# Altium schematic sheet Memory.SchDoc
size A4; SheetNumber: 5; SheetTotal: 9
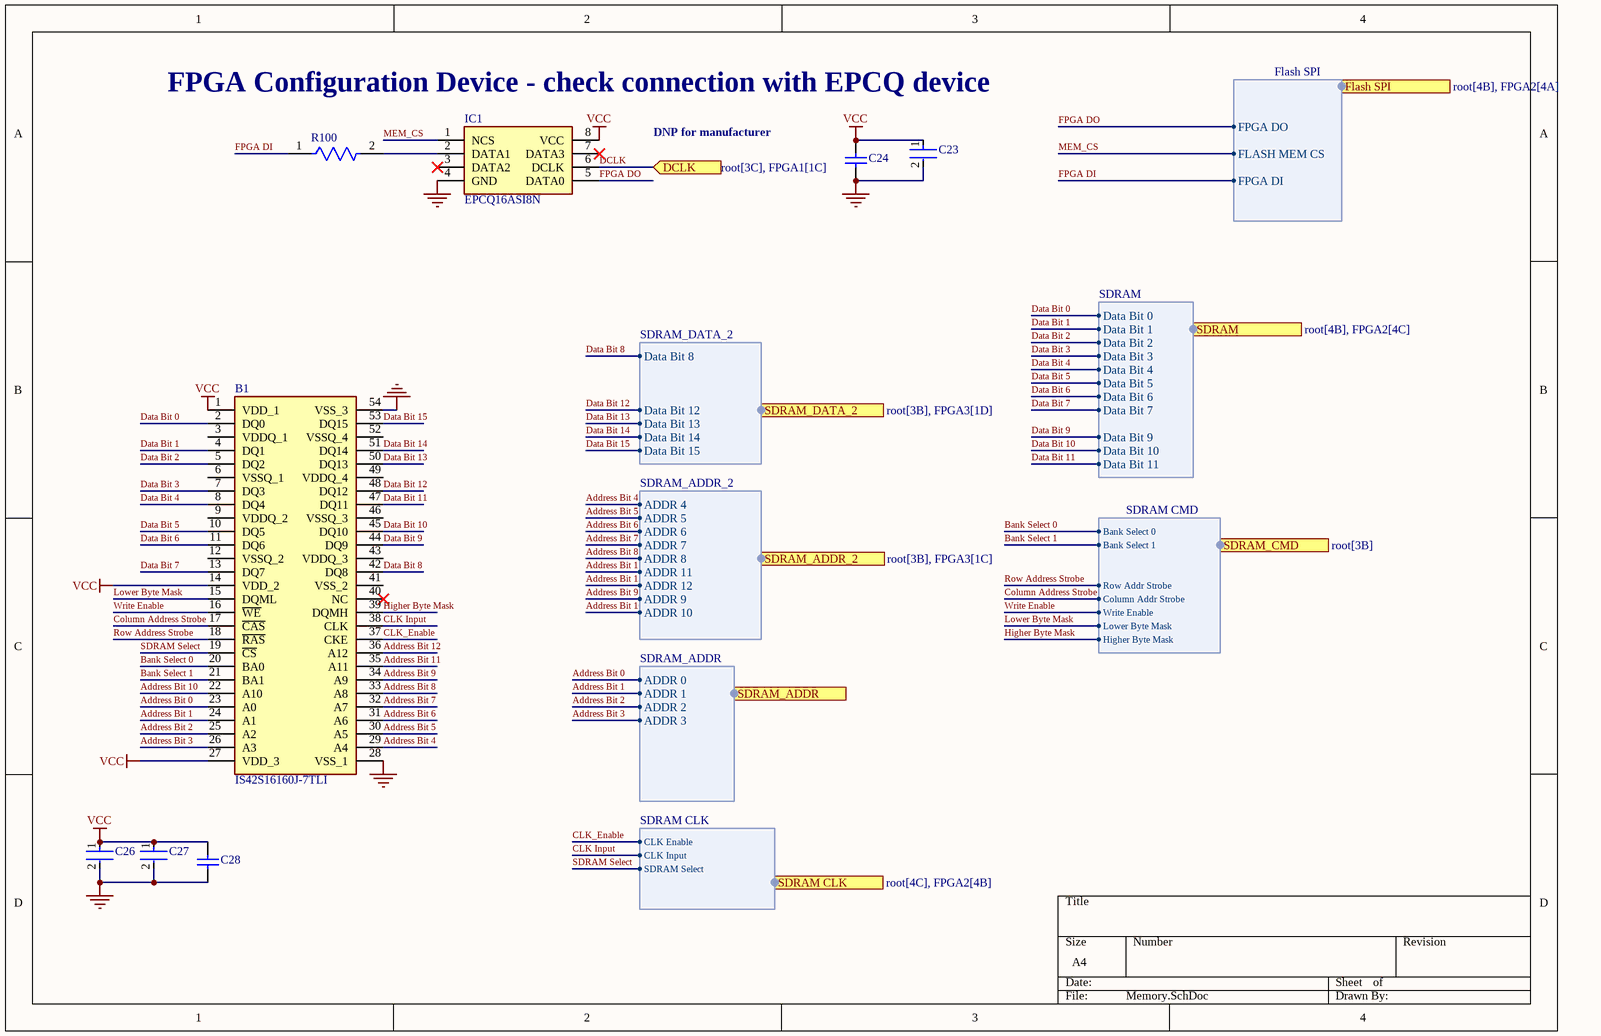
[diagram p0: Memory.SchDoc]

## Parts
B1  IS42S16160J-7TLI  [SOP80P1176X120-54N]
C23  CC0402KRX7R7BB104  [FP-CC0402-MFG]  (value not drawn)
C24  C0603C105K9PACTU  [CAPC1608X90X35LL15T15]  (value not drawn)
C26  CC0603KRX7R9BB104  [FP-CC0603-DA-MFG]  (value not drawn)
C27  CL21A475KAQNNNE  [FP-CL21-IPC_A]  (value not drawn)
C28  C0603C105K9PACTU  [CAPC1608X90X35LL15T15]  (value not drawn)
IC1  EPCQ16ASI8N  [SOIC127P600X175-8N]
R100  RC0402JR-0722RL  [FP-RC0402-0_4-IPC_B]  (value not drawn)

## Ports
DCLK (in, see root[3C], FPGA1[1C]), Flash SPI (harness Flash SPI, see root[4B], FPGA2[4A]), SDRAM (harness SDRAM, see root[4B], FPGA2[4C]), SDRAM CLK (harness SDRAM CLK, see root[4C], FPGA2[4B]), SDRAM_ADDR (harness SDRAM_ADDR, see root[4B], FPGA2[4C]), SDRAM_ADDR_2 (harness SDRAM_ADDR_2, see root[3B], FPGA3[1C]), SDRAM_CMD (harness SDRAM CMD, see root[3B]), SDRAM_DATA_2 (harness SDRAM_DATA_2, see root[3B], FPGA3[1D])

## Harnesses
Flash SPI: FPGA DO, FLASH MEM CS, FPGA DI
SDRAM: Data Bit 0, Data Bit 1, Data Bit 2, Data Bit 3, Data Bit 4, Data Bit 5, Data Bit 6, Data Bit 7, Data Bit 9, Data Bit 10, Data Bit 11
SDRAM_ADDR: ADDR 0, ADDR 1, ADDR 2, ADDR 3
SDRAM CMD: Bank Select 0, Bank Select 1, Row Addr Strobe, Column Addr Strobe, Write Enable, Lower Byte Mask, Higher Byte Mask
SDRAM CLK: CLK Enable, CLK Input, SDRAM Select
SDRAM_ADDR_2: ADDR 4, ADDR 5, ADDR 6, ADDR 7, ADDR 8, ADDR 11, ADDR 12, ADDR 9, ADDR 10
SDRAM_DATA_2: Data Bit 12, Data Bit 13, Data Bit 14, Data Bit 15, Data Bit 8

## Nets
GND: B1.28(VSS_1) B1.54(VSS_3) C23.2 C24.1 C26.2 C27.2 C28.1 IC1.4(GND)
VCC: B1.1(VDD_1) B1.14(VDD_2) B1.27(VDD_3) C23.1 C24.2 C26.1 C27.1 C28.2 IC1.8(VCC)
Address Bit 0: B1.23(A0) ; port SDRAM_ADDR.ADDR 0
Address Bit 1: B1.24(A1) ; port SDRAM_ADDR.ADDR 1
Address Bit 2: B1.25(A2) ; port SDRAM_ADDR.ADDR 2
Address Bit 3: B1.26(A3) ; port SDRAM_ADDR.ADDR 3
Address Bit 4: B1.29(A4) ; port SDRAM_ADDR_2.ADDR 4
Address Bit 5: B1.30(A5) ; port SDRAM_ADDR_2.ADDR 5
Address Bit 6: B1.31(A6) ; port SDRAM_ADDR_2.ADDR 6
Address Bit 7: B1.32(A7) ; port SDRAM_ADDR_2.ADDR 7
Address Bit 8: B1.33(A8) ; port SDRAM_ADDR_2.ADDR 8
Address Bit 9: B1.34(A9) ; port SDRAM_ADDR_2.ADDR 9
Address Bit 10: B1.22(A10) ; port SDRAM_ADDR_2.ADDR 10
Address Bit 11: B1.35(A11) ; port SDRAM_ADDR_2.ADDR 11
Address Bit 12: B1.36(A12) ; port SDRAM_ADDR_2.ADDR 12
Bank Select 0: B1.20(BA0) ; port SDRAM_CMD.Bank Select 0
Bank Select 1: B1.21(BA1) ; port SDRAM_CMD.Bank Select 1
CLK Input: B1.38(CLK) ; port SDRAM CLK.CLK Input
CLK_Enable: B1.37(CKE) ; port SDRAM CLK.CLK Enable
Column Address Strobe: B1.17(~{CAS}) ; port SDRAM_CMD.Column Addr Strobe
Data Bit 0: B1.2(DQ0) ; port SDRAM.Data Bit 0
Data Bit 1: B1.4(DQ1) ; port SDRAM.Data Bit 1
Data Bit 2: B1.5(DQ2) ; port SDRAM.Data Bit 2
Data Bit 3: B1.7(DQ3) ; port SDRAM.Data Bit 3
Data Bit 4: B1.8(DQ4) ; port SDRAM.Data Bit 4
Data Bit 5: B1.10(DQ5) ; port SDRAM.Data Bit 5
Data Bit 6: B1.11(DQ6) ; port SDRAM.Data Bit 6
Data Bit 7: B1.13(DQ7) ; port SDRAM.Data Bit 7
Data Bit 8: B1.42(DQ8) ; port SDRAM_DATA_2.Data Bit 8
Data Bit 9: B1.44(DQ9) ; port SDRAM.Data Bit 9
Data Bit 10: B1.45(DQ10) ; port SDRAM.Data Bit 10
Data Bit 11: B1.47(DQ11) ; port SDRAM.Data Bit 11
Data Bit 12: B1.48(DQ12) ; port SDRAM_DATA_2.Data Bit 12
Data Bit 13: B1.50(DQ13) ; port SDRAM_DATA_2.Data Bit 13
Data Bit 14: B1.51(DQ14) ; port SDRAM_DATA_2.Data Bit 14
Data Bit 15: B1.53(DQ15) ; port SDRAM_DATA_2.Data Bit 15
DCLK: IC1.6(DCLK) ; port DCLK
FPGA DI: R100.1 ; port Flash SPI.FPGA DI
FPGA DO: IC1.5(DATA0) ; port Flash SPI.FPGA DO
Higher Byte Mask: B1.39(DQMH) ; port SDRAM_CMD.Higher Byte Mask
Lower Byte Mask: B1.15(DQML) ; port SDRAM_CMD.Lower Byte Mask
MEM_CS: IC1.1(NCS) ; port Flash SPI.FLASH MEM CS
Row Address Strobe: B1.18(~{RAS}) ; port SDRAM_CMD.Row Addr Strobe
SDRAM Select: B1.19(~{CS}) ; port SDRAM CLK.SDRAM Select
Write Enable: B1.16(~{WE}) ; port SDRAM_CMD.Write Enable
NetIC1_2: IC1.2(DATA1) R100.2

Not connected (* = marked no-connect by the designer): B1 3(VDDQ_1) 6(VSSQ_1) 9(VDDQ_2) 12(VSSQ_2) 40(NC)* 41(VSS_2) 43(VDDQ_3) 46(VSSQ_3) 49(VDDQ_4) 52(VSSQ_4); IC1 3(DATA2)* 7(DATA3)*

## Notes on the sheet
- FPGA Configuration Device - check connection with EPCQ device
- DNP for manufacturer

## Library data of the parts
B1 = CMP-007-000000-1: DRAM 256M, 3.3V, SDRAM 16Mx16 143MHz; Manufacturer_Name: Integrated Silicon Solution Inc.; Geometry.Height: 1.2mm; Mouser Part Number: 870-IS42S16160J-7TLI; Mouser Price/Stock: https://www.mouser.co.uk/ProductDetail/ISSI/IS42S16160J-7TLI?qs=uCnMRCNammmen%252BmWnq1g5A%3D%3D; Source: IS42S16160J-7TLI.SchLib; Datasheet Link: http://www.issi.com/WW/pdf/42-45S83200J-16160J.pdf; Manufacturer_Part_Number: IS42S16160J-7TLI; Design Item ID: IS42S16160J-7TLI
C23 = CMP-03422-000048-1: CAP CER 0.1UF 16V X7R 0402; Manufacturer: YAGEO; Material: Ceramic; Automotive Grade: NA; Capacitance: 100 nF; Temperature Coefficient: 30ppm/°C; Tolerance: 0.1; Value: 100 nF; Device Class L1: Passive Components; Temperature Range Low: -55°C; Device Class L3: Ceramic Capacitors; Temperature Characteristic: X7R; Ipc Land Pattern Name: CAPC10050X50; Temperature Range High: +125°C; Voltage Rating: 16 V; Temperature: -55°C to +125°C; RoHS: TRUE; Automotive: No; Height: 0.55mm; Device Class L2: Capacitors; Digikey Description: CAP CER 0.1UF 16V X7R 0402; Package: CC0402; Footprint Url: http://www.yageo.com/exep/pages/download/literatures/UPY-C_GEN_24.pdf; ComponentLink2Description: Datasheet; Category: Cap; Lead Free: Yes; Octopart: https://octopart.com/cc0402krx7r7bb104-yageo-42244624; ComponentLink2URL: http://www.yageo.com/documents/recent/UPY-GP_NP0_16V-to-50V_16.pdf; Manufacturer Part Number: CC0402KRX7R7BB104; Mouser Description: 0402 0.1 uF 16 V ±10 % Tolerance X7R SMT Multilayer Ceramic Capacitor
C24 C28 = CMP-2006-02241-1: Manufacturer: Kemet; Part Number: C0603C105K9PACTU
C26 = CMP-2100-03601-2: CAP CER 0.1UF 50V X7R 0603; Manufacturer: YAGEO; Material: Ceramic; Capacitance: 100 nF; Temperature Coefficient: 15%; Tolerance: 0.1; Value: 100 nF; Height: 0.9mm; Voltage: 50 V; ComponentLink2Description: Datasheet; Device Class L2: Capacitors; Temperature Range High: +125°C; Category: Cap; Footprint Url: http://www.yageo.com/exep/pages/download/literatures/UPY-C_GEN_24.pdf; ComponentLink2URL: http://www.yageo.com/documents/recent/UPY-GPHC_X7R_6.3V-to-50V_18.pdf; Package: CC0603-DA; Temperature: -55°C to +125°C; Voltage Rating: 50 V; Temperature Characteristic: X7R; Device Class L1: Passive Components; Temperature Range Low: -55°C; Manufacturer Part Number: CC0603KRX7R9BB104; RoHS: TRUE; Automotive: No; Device Class L3: Ceramic Capacitors; Octopart: https://octopart.com/cc0603krx7r9bb104-yageo-42244635; Mouser Description: Multilayer Ceramic Capacitor, CC Series, 0.1 - F, - 10%, X7R, 50 V, 0603 [1608 Metric]; Lead Free: Yes; Digikey Description: CAP CER 0.1UF 50V X7R 0603
C27 = CMP-13271-002624-1: CL21 Series 0805 4.7uF 25V ±10% Tolerance X5R Multilayer Ceramic Chip Capacitor; Case Code (Imperial): 0805; Thickness: 0.055inch; Mount: Surface Mount; Case Code (Metric): 2012; Capacitance: 4.7uF; Depth: 1.25mm; Lead Free: Lead Free; Case/Package: 0805; Voltage Rating: 25V; Package Quantity: 1; Width: 0.049inch; Radiation Hardening: No; Voltage Rating (DC): 25V; Length: 2mm; Dielectric: X5R; Height: 1.25mm; Packaging: Tape and Reel; Tolerance: 10%; Min Operating Temperature: -55°C; Max Operating Temperature: 85°C
IC1 = EPCQ16ASI8N: Integrated Circuit; Manufacturer_Name: Intel; Datasheet Link: https://www.altera.com/content/dam/altera-www/global/en_US/pdfs/literature/hb/cfg/cfg_cf52014.pdf; Height: 1.75mm; Manufacturer_Part_Number: EPCQ16ASI8N; Mouser Part Number: 989-EPCQ16ASI8N; Mouser Price/Stock: https://www.mouser.co.uk/ProductDetail/Altera/EPCQ16ASI8N?qs=EU6FO9ffTwfG9ViUTMZ%252BJw%3D%3D; Arrow Part Number: EPCQ16ASI8N; Arrow Price/Stock: https://www.arrow.com/en/products/epcq16asi8n/altera?utm_currency=USD&region=nac
R100 = CMP-2002-07961-2: RES SMD 22 OHM 5% 1/16W 0402; Max Power Dissipation: 63mW; Power Rating: 62.5mW; Resistance: 22R; Voltage Rating: 50V; Temperature Coefficient: 100ppm/°C; Termination: SMD/SMT; Length: 0.039inch; Construction: Rectangular; Case Code (Metric): 1005; RoHS Compliant: Yes; Width: 0.02inch; Resistance Tolerance: 5%; Size Code: 0402; Military Standard: Not; Max Operating Temperature: 155°C; REACH SVHC: No SVHC; Lead Free: Lead Free; Number of Terminations: 2; Depth: 0.5mm; Height: 0.016inch; Tolerance: 5%; Min Operating Temperature: -55°C; Resistor Type: Thick Film; Series: RC; Case Code (Imperial): 0402; Features: Moisture Resistant; Packaging: Tape and Reel; Case/Package: 0402; Package Quantity: 1